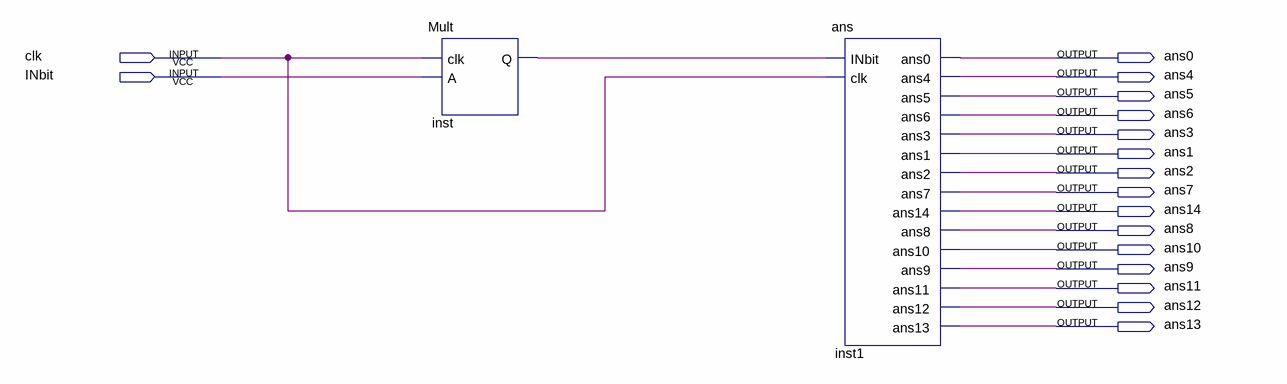
[diagram p0: schematic sheet]
// Quartus schematic test1.bdf as structural Verilog: 2 symbols, 17 pins
module test1 (
  input  clk,
  input  INbit,
  output ans0,
  output ans4,
  output ans5,
  output ans6,
  output ans3,
  output ans1,
  output ans2,
  output ans7,
  output ans14,
  output ans8,
  output ans10,
  output ans9,
  output ans11,
  output ans12,
  output ans13
);

  wire inst_q;

  Mult inst (.clk(clk), .A(INbit), .Q(inst_q));
  ans inst1 (
    .INbit(inst_q), .clk(clk), .ans0(ans0), .ans4(ans4), .ans5(ans5), .ans6(ans6), .ans3(ans3), .ans1(ans1),
    .ans2(ans2), .ans7(ans7), .ans14(ans14), .ans8(ans8), .ans10(ans10), .ans9(ans9), .ans11(ans11),
    .ans12(ans12), .ans13(ans13));
endmodule
